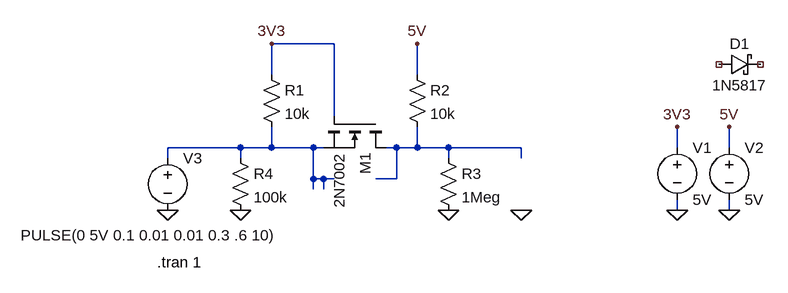
[diagram p0: schematic voltage_conversion.asc]
voltage_conversion.asc, the LTspice schematic file:
Version 4
SHEET 1 880 680
WIRE 112 -176 16 -176
WIRE 16 -128 16 -176
WIRE 240 -128 240 -176
WIRE 112 -64 112 -176
WIRE -32 -16 -144 -16
WIRE 16 -16 16 -48
WIRE 16 -16 -32 -16
WIRE 80 -16 16 -16
WIRE 96 -16 80 -16
WIRE 208 -16 192 -16
WIRE 240 -16 240 -48
WIRE 240 -16 208 -16
WIRE 288 -16 240 -16
WIRE 400 -16 288 -16
WIRE 640 -16 640 -48
WIRE 720 -16 720 -48
WIRE -144 0 -144 -16
WIRE -32 0 -32 -16
WIRE 288 0 288 -16
WIRE 400 0 400 -16
WIRE 80 32 80 -16
WIRE 96 32 80 32
WIRE 112 32 96 32
WIRE 208 32 208 -16
WIRE 208 32 176 32
WIRE 80 48 80 32
WIRE 96 48 96 32
WIRE 640 80 640 64
WIRE 720 80 720 64
FLAG 16 -176 3V3
FLAG 240 -176 5V
FLAG 288 80 0
FLAG -32 80 0
FLAG 640 80 0
FLAG 720 80 0
FLAG -144 80 0
FLAG 640 -48 3V3
FLAG 720 -48 5V
FLAG 400 80 0
SYMBOL nmos 192 -64 R90
SYMATTR InstName M1
SYMATTR Value 2N7002
SYMBOL res 0 -144 R0
SYMATTR InstName R1
SYMATTR Value 10k
SYMBOL res 224 -144 R0
SYMATTR InstName R2
SYMATTR Value 10k
SYMBOL res 272 -16 R0
SYMATTR InstName R3
SYMATTR Value 1Meg
SYMBOL res -48 -16 R0
SYMATTR InstName R4
SYMATTR Value 100k
SYMBOL voltage 640 -32 R0
WINDOW 123 0 0 Left 0
WINDOW 39 0 0 Left 0
SYMATTR InstName V1
SYMATTR Value 5V
SYMBOL voltage 720 -32 R0
WINDOW 123 0 0 Left 0
WINDOW 39 0 0 Left 0
SYMATTR InstName V2
SYMATTR Value 5V
SYMBOL voltage -144 -16 R0
WINDOW 3 -226 135 Left 2
WINDOW 123 0 0 Left 0
WINDOW 39 0 0 Left 0
SYMATTR Value PULSE(0 5V 0.1 0.01 0.01 0.3 .6 10)
SYMATTR InstName V3
SYMBOL schottky 704 -128 R270
WINDOW 0 32 32 VTop 2
WINDOW 3 0 32 VBottom 2
SYMATTR InstName D1
SYMATTR Value 1N5817
SYMATTR Description Diode
SYMATTR Type diode
TEXT -160 160 Left 2 !.tran 1

The netlist it stands for:
* voltage_conversion.asc
M1 N002 3V3 N001 N001 2N7002
R1 3V3 N001 10k
R2 5V N002 10k
R3 N002 0 1Meg
R4 N001 0 100k
V1 3V3 0 5V
V2 5V 0 5V
V3 N001 0 PULSE(0 5V 0.1 0.01 0.01 0.3 .6 10)
D1 NC_01 NC_02 1N5817
.model D D
.lib standard.dio
.model NMOS NMOS
.model PMOS PMOS
.lib standard.mos
.tran 1
.backanno
.end